# Altium schematic sheet main_robot_mpu.SchDoc
size A2
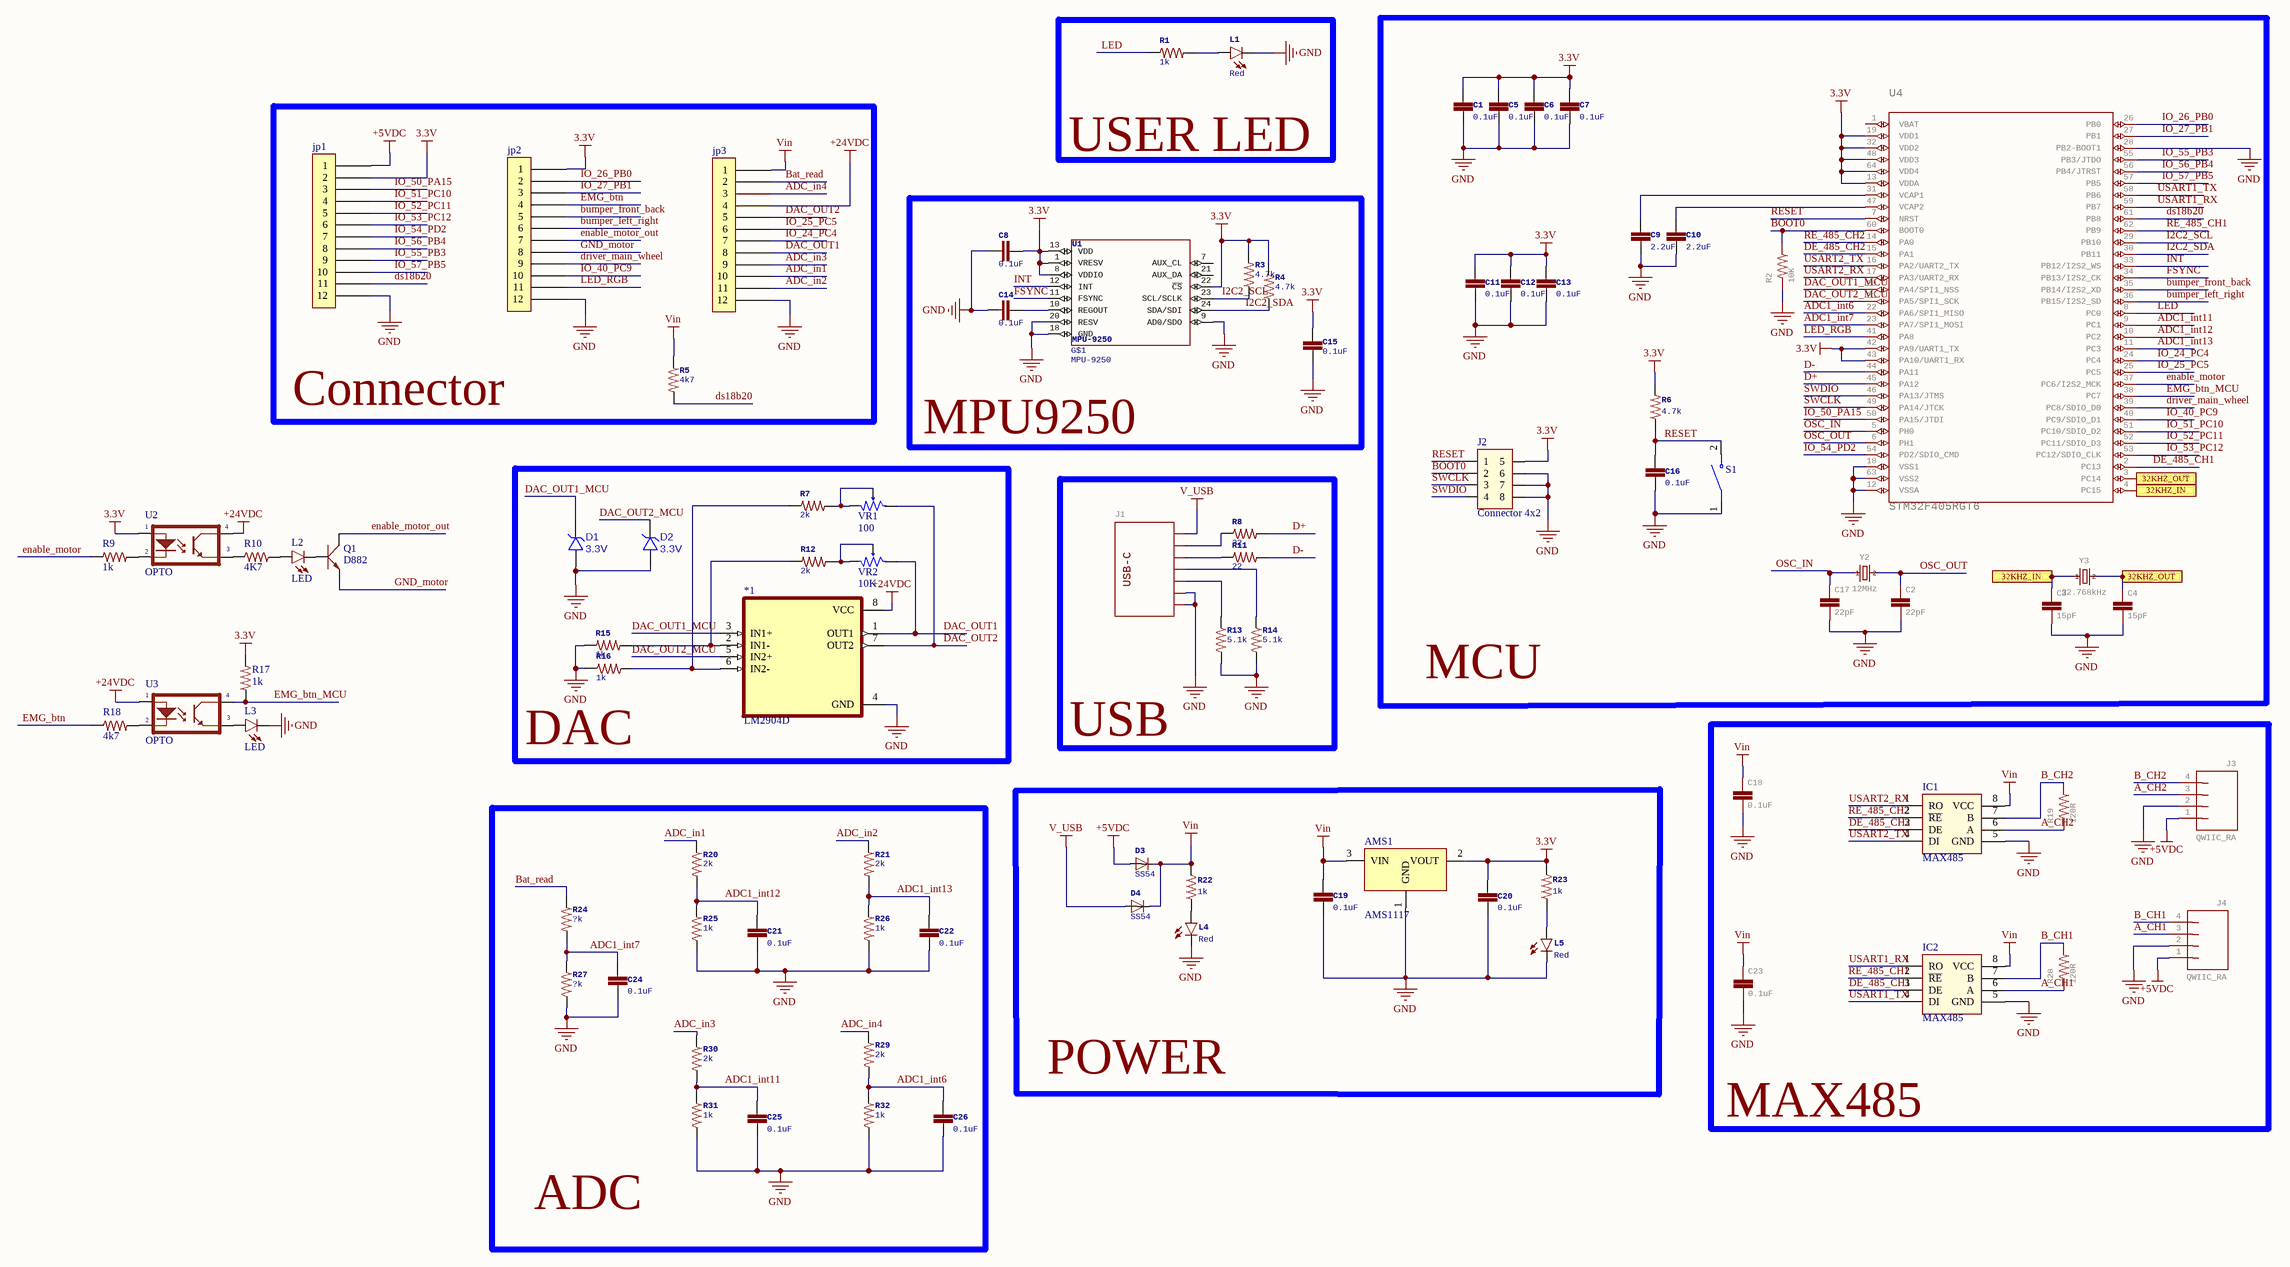
[diagram p0: main_robot_mpu.SchDoc]

## Parts
*1  LM2904D  [SOIC 8]
AMS1  AMS1117  [SOT89]
C1  0.1uF  [CAP_SMD0603]
C2  22pF  [0603-CAP]
C3  15pF  [0603-CAP]
C4  15pF  [0603-CAP]
C5  0.1uF  [CAP_SMD0603]
C6  0.1uF  [CAP_SMD0603]
C7  0.1uF  [CAP_SMD0603]
C8  0.1uF  [CAP_SMD0603]
C9  2.2uF  [CAP_SMD0603]
C10  2.2uF  [CAP_SMD0603]
C11  0.1uF  [CAP_SMD0603]
C12  0.1uF  [CAP_SMD0603]
C13  0.1uF  [CAP_SMD0603]
C14  0.1uF  [CAP_SMD0603]
C15  0.1uF  [CAP_SMD0603]
C16  0.1uF  [CAP_SMD0603]
C17  22pF  [0603-CAP]
C18  0.1uF  [0603-CAP]
C19  0.1uF  [CAP_SMD0603]
C20  0.1uF  [CAP_SMD0603]
C21  0.1uF  [CAP_SMD0603]
C22  0.1uF  [CAP_SMD0603]
C23  0.1uF  [0603-CAP]
C24  0.1uF  [CAP_SMD0603]
C25  0.1uF  [CAP_SMD0603]
C26  0.1uF  [CAP_SMD0603]
D1  3.3V  [SOD323]
D2  3.3V  [SOD323]
D3  SS54  [SMB]
D4  SS54  [SMB]
IC1  MAX485  [SO-8]
IC2  MAX485  [SO-8]
J1  USB_C_2-LAYER_PADS  [USB-C-16P-2LAYER-PADS]  (value not drawn)
J2  Connector 4x2  [JP4x2]
J3  QWIIC_RA  [JST04_1MM_RA]
J4  QWIIC_RA  [JST04_1MM_RA]
jp1  jumper 12p 2.54mm  [jumper 12p 2.54mm]  (value not drawn)
jp2  jumper 12p 2.54mm  [jumper 12p 2.54mm]  (value not drawn)
jp3  jumper 12p 2.54mm  [jumper 12p 2.54mm]  (value not drawn)
L1  Red  [LED_RED_SMD_0603]
L2  LED  [LED_GREEN_SMD_0603]
L3  LED  [LED_RED_SMD_0603]
L4  Red  [LED_YELLOW_SMD_0603]
L5  Red  [LED_GREEN_SMD_0603]
Q1  D882  [SOT89]
R1  1k  [RES_SMD0603]
R2  10K  [0603-RES]
R3  4.7k  [RES_SMD0603]
R4  4.7k  [RES_SMD0603]
R5  4k7  [RES_SMD0603]
R6  4.7k  [RES_SMD0603]
R7  2k  [RES_SMD0603]
R8  22  [RES_SMD0603]
R9  1k  [RES_SMD0603]
R10  4K7  [RES_SMD0603]
R11  22  [RES_SMD0603]
R12  2k  [RES_SMD0603]
R13  5.1k  [RES_SMD0603]
R14  5.1k  [RES_SMD0603]
R15  1k  [RES_SMD0603]
R16  1k  [RES_SMD0603]
R17  1k  [RES_SMD0603]
R18  4k7  [RES_SMD0603]
R19  120R  [0603-RES]
R20  2k  [RES_SMD0603]
R21  2k  [RES_SMD0603]
R22  1k  [RES_SMD0603]
R23  1k  [RES_SMD0603]
R24  ?k  [RES_SMD0603]
R25  1k  [RES_SMD0603]
R26  1k  [RES_SMD0603]
R27  ?k  [RES_SMD0603]
R28  120R  [0603-RES]
R29  2k  [RES_SMD0603]
R30  2k  [RES_SMD0603]
R31  1k  [RES_SMD0603]
R32  1k  [RES_SMD0603]
S1  PTS636_SM43J_SMTR_LFS  [BUTTON_3x4]  (value not drawn)
U1  MPU-9250  GateName_1: G$1  [QFN-24]
U2  OPTO  [SOP4]
U3  OPTO  [SOP4]
U4  STM32F405RGT6  [TQFP64]
VR1  100  [VR - SMD]
VR2  10K  [VR - SMD]
Y2  12MHz  [CRYSTAL-SMD-5X3.2-4PAD]
Y3  32.768kHz  [CRYSTAL-SMD-3.2X1.5MM]

## Ports
32KHZ_IN (in), 32KHZ_OUT (in)

## Nets
3.3V: AMS1.2(VOUT) C1.2 C5.2 C6.2 C7.2 C8.1 C11.2 C12.2 C13.2 C15.1 C20.2 J2.5 jp1.2 jp2.1 R3.1 R4.1 R6.1 R17.1 R23.1 U1.1(VRESV) U1.8(VDDIO) U1.13(VDD) U1.22(~{CS}) U2.1(A) U4.13(VDDA) U4.19(VDD1) U4.32(VDD2) U4.42(PA9/UART1_TX) U4.43(PA10/UART1_RX) U4.48(VDD3) U4.64(VDD4)
+5VDC: D3.1 J3.1 J4.1 jp1.1
+24VDC: *1.8(VCC) jp3.4 U2.4(C) U3.1(A)
GND: *1.4(GND) AMS1.1(GND) C1.1 C2.1 C3.1 C4.1 C5.1 C6.1 C7.1 C8.2 C9.1 C10.1 C11.1 C12.1 C13.1 C14.2 C15.2 C16.1 C17.1 C18.1 C19.1 C20.1 C21.1 C22.1 C23.1 C24.1 C25.1 C26.1 D1.A D2.A IC1.5(GND) IC2.5(GND) J1.GND J1.SHLD1(SHLD) J2.6 J2.7 J2.8 J3.2 J4.2 jp1.12 jp2.12 jp3.12 L1.2(POS) L3.2(POS) L4.2(POS) L5.2(POS) R2.1 R13.1 R14.1 R15.1 R16.1 R25.1 R26.1 R27.1 R31.1 R32.1 S1.1(COM) U1.9(AD0/SDO) U1.18(GND) U1.20(RESV) U4.12(VSSA) U4.18(VSS1) U4.28(PB2-BOOT1) U4.63(VSS2)
V_USB: D4.1 J1.VBUS1(VBUS)
Vin: AMS1.3(VIN) C18.2 C19.2 C23.2 D3.2 D4.2 IC1.8(VCC) IC2.8(VCC) jp3.1 R5.2 R22.1
32KHZ_IN: C3.2 U4.4(PC15) Y3.1 ; port 32KHZ_IN
32KHZ_OUT: C4.2 U4.3(PC14) Y3.3 ; port 32KHZ_OUT
A_CH1: IC2.6(A) J4.3 R28.1
A_CH2: IC1.6(A) J3.3 R19.1
ADC1_int6: C26.2 R29.1 R32.2 U4.22(PA6/SPI1_MISO)
ADC1_int7: C24.2 R24.1 R27.2 U4.23(PA7/SPI1_MOSI)
ADC1_int11: C25.2 R30.1 R31.2 U4.9(PC1)
ADC1_int12: C21.2 R20.1 R25.2 U4.10(PC2)
ADC1_int13: C22.2 R21.1 R26.2 U4.11(PC3)
ADC_in1: jp3.10 R20.2
ADC_in2: jp3.11 R21.2
ADC_in3: jp3.9 R30.2
ADC_in4: jp3.3 R29.2
B_CH1: IC2.7(B) J4.4 R28.2
B_CH2: IC1.7(B) J3.4 R19.2
Bat_read: jp3.2 R24.2
BOOT0: J2.2 R2.2 U4.60(BOOT0)
bumper_front_back: jp2.5 U4.35(PB14/I2S2_XD)
bumper_left_right: jp2.6 U4.36(PB15/I2S2_SD)
D+: R8.2 U4.45(PA12)
D-: R11.2 U4.44(PA11)
DAC_OUT1: *1.1(OUT1) jp3.8 VR2.3
DAC_OUT1_MCU: *1.3(IN1+) D1.K U4.20(PA4/SPI1_NSS)
DAC_OUT2: *1.7(OUT2) jp3.5 VR1.3
DAC_OUT2_MCU: *1.5(IN2+) D2.K U4.21(PA5/SPI1_SCK)
DE_485_CH1: IC2.3(DE) U4.2(PC13)
DE_485_CH2: IC1.3(DE) U4.15(PA1)
driver_main_wheel: jp2.9 U4.39(PC8/SDIO_D0)
ds18b20: jp1.11 R5.1 U4.61(PB8)
EMG_btn: jp2.4 R18.2
EMG_btn_MCU: R17.2 U3.4(C) U4.38(PC7)
enable_motor: R9.2 U4.37(PC6/I2S2_MCK)
enable_motor_out: jp2.7 Q1.3(COLLECTOR)
FSYNC: U1.11(FSYNC) U4.34(PB13/I2S2_CK)
GND_motor: jp2.8 Q1.2(EMITTER)
I2C2_SCL: R3.2 U1.23(SCL/SCLK) U4.29(PB10)
I2C2_SDA: R4.2 U1.24(SDA/SDI) U4.30(PB11)
INT: U1.12(INT) U4.33(PB12/I2S2_WS)
IO_24_PC4: jp3.7 U4.24(PC4)
IO_25_PC5: jp3.6 U4.25(PC5)
IO_26_PB0: jp2.2 U4.26(PB0)
IO_27_PB1: jp2.3 U4.27(PB1)
IO_40_PC9: jp2.10 U4.40(PC9/SDIO_D1)
IO_50_PA15: jp1.3 U4.50(PA15/JTDI)
IO_51_PC10: jp1.4 U4.51(PC10/SDIO_D2)
IO_52_PC11: jp1.5 U4.52(PC11/SDIO_D3)
IO_53_PC12: jp1.6 U4.53(PC12/SDIO_CLK)
IO_54_PD2: jp1.7 U4.54(PD2/SDIO_CMD)
IO_55_PB3: jp1.9 U4.55(PB3/JTDO)
IO_56_PB4: jp1.8 U4.56(PB4/JTRST)
IO_57_PB5: jp1.10 U4.57(PB5)
LED: R1.2 U4.8(PC0)
LED_RGB: jp2.11 U4.41(PA8)
OSC_IN: C17.2 U4.5(PH0) Y2.1
OSC_OUT: C2.2 U4.6(PH1) Y2.3
RE_485_CH1: IC2.2(~{RE}) U4.62(PB9)
RE_485_CH2: IC1.2(~{RE}) U4.14(PA0)
RESET: C16.2 J2.1 R6.2 S1.2(NO) U4.7(NRST)
SWCLK: J2.3 U4.49(PA14/JTCK)
SWDIO: J2.4 U4.46(PA13/JTMS)
USART1_RX: IC2.1(RO) U4.59(PB7)
USART1_TX: IC2.4(DI) U4.58(PB6)
USART2_RX: IC1.1(RO) U4.17(PA3/UART2_RX)
USART2_TX: IC1.4(DI) U4.16(PA2/UART2_TX)
Net*1_2: *1.2(IN1-) R12.1 R15.2
Net*1_6: *1.6(IN2-) R7.1 R16.2
NetC9_2: C9.2 U4.31(VCAP1)
NetC10_2: C10.2 U4.47(VCAP2)
NetC14_1: C14.1 U1.10(REGOUT)
NetJ1_A5: J1.A5(CC1) R14.2
NetJ1_A6: J1.A6(D+) R8.1
NetJ1_A7: J1.A7(D-) R11.1
NetJ1_B5: J1.B5(CC2) R13.2
NetL1_1: L1.1(NEG) R1.1
NetL2_1: L2.1(NEG) R10.1
NetL2_2: L2.2(POS) Q1.1(BASE)
NetL3_1: L3.1(NEG) U3.3(E)
NetL4_1: L4.1(NEG) R22.2
NetL5_1: L5.1(NEG) R23.2
NetR7_2: R7.2 VR1.1 VR1.2
NetR9_1: R9.1 U2.2(K)
NetR10_2: R10.2 U2.3(E)
NetR12_2: R12.2 VR2.1 VR2.2
NetR18_1: R18.1 U3.2(K)

Not connected (* = marked no-connect by the designer): J1 B6(D+) B7(D-) SHLD2(SHLD) SHLD3(SHLD) SHLD4(SHLD) VBUS2(VBUS); U1 7(AUX_CL) 21(AUX_DA); U4 1(VBAT)

## Notes on the sheet
- Labels drawn without touching a wire or pin: ADC, Connector, DAC, MAX485, MCU, MPU9250, POWER, USB, USER LED
- Name
- Date
- Sign
- Designer
- Checker
- Address:
- TEL:
- Website:
- Drawing:
- Size:
- A3
- Sheet:
- /
- Code:

## Library data of the parts
C1 C5-C16 C19-C22 C24-C26 = Cap
C2-C4 C17 C18 C23 = CAP0603-CAP: CapacitorStandard 0603 ceramic capacitor, and 0.1" leaded capacitor.; GateName_1: G$1; SymbolName_1: CAP; DeviceName: 0603-CAP; LibraryName: SparkFun; DeviceSetName: CAP
D1 D2 = DIODE_ZENER_3V3_SOD323: Diode Zener SMD 3.3V 200mW SOD-323; Manufacturer 1: ON Semiconductor; Manufacturer Part Number 1: MM3Z3V3ST1G; Ratings: 3.3V; 0.2W; Vf=900mV @ 10mA; Material: Si; Tolerance: ±3%; SCDType: source; Package / Case: SOD-323; Diode Type: Zener; Supplier 1: Digi-Key; Supplier Part Number 1: MM3Z3V3ST1GOSCT-ND
D3 D4 = DIODE
IC1 IC2 = MAX485: RS232 - RS485 (Same sn75176)
J1 = USB_C_2-LAYER_PADS: USB Type C 16Pin Connector Super Speed pins not available on the 16-pin purely SMD connector so this part is best for USB 2.0 implementations. D1 and D2 are tied together enabling D+/- no matter which way the cable is plugged into the connector. The two channel configuration pins (CC1/2) are exposed. These are normally connected to ground via 5.1k resistors but can be reconfigured for high current/high power applications.; GateName_1: J1; SymbolName_1: USB-C-MINIMUM; DeviceSetName: USB_C; PROD_ID: CONN-14122; DeviceName: _2-LAYER_PADS; LibraryName: SparkFun-Connectors; USB-C: USB-C
J2 = JP4x2: Value: Connector 4x2
J3 J4 = QWIIC_CONNECTORJS-1MM: SparkFun I2C Standard Qwiic Connector An SMD 1mm pitch JST connector makes it easy and quick (get it? Qwiic?) to connect I2C devices to each other. The Qwiic system enables fast and solderless connection between popular platforms and various sensors and actuators.   We carry 200mm, 100mm, 50mm, and breadboard friendly Qwiic cables. We also offer 10 pcs strips the SMD connectors.; GateName_1: G$1; SymbolName_1: I2C_STANDARD; DeviceName: JS-1MM; PROD_ID: CONN-13694; LibraryName: SparkFun-Connectors; DeviceSetName: QWIIC_CONNECTOR
jp1-jp3 = jumper 12p 2.54mm: jp 12p 2.54mm
L1-L5 = LED: Lighting Eminter Diode
Q1 = Tranzitor NPN: pin to pad: 2>3 3>2
R1 R3-R18 R20-R27 R29-R32 = Resistor
R2 R19 R28 = RESISTOR0603-RES: ResistorBasic schematic elements and footprints for 0603, 1206, and PTH resistors.; GateName_1: G$1; SymbolName_1: RESISTOR; DeviceName: 0603-RES; LibraryName: SparkFun; DeviceSetName: RESISTOR
S1 = PTS636_SM43J_SMTR_LFS: Tactile Switch SPST-NO Top Actuated Surface Mount; MP: PTS636 SM43J SMTR LFS; MF: C&K; Package: None; Value: *; Availability: Unavailable; Price: None; SnapEDA_Link: https://www.snapeda.com/parts/PTS636%20SM43J%20SMTR%20LFS/C%26K/view-part/4478349/?ref=snap
U1 = MPU-9250: 9-axis MotionTracking: 3-Axis gyroscope, 3-Axis accelerometer, 3-Axis magnetometer NC pin 19. 2-6 & 14-17 not internally connected. May be used for PCB trace routing.; PROD_ID: IC-13192; SymbolName_1: MPU-9250; LibraryName: 9dof-devboard-temp; DeviceSetName: MPU-9250
U4 = STM32F405RG: STM32F405RGT6    ARM DSP Chip used on the WAV Trigger board. IC MCU 32BIT 1MB FLASH 64LQFP   Datasheet SparkFun Products  WAV Trigger (WIG-13660); GateName_1: G$1; PROD_ID: IC-11709; SymbolName_1: STM32F405RG; LibraryName: STM32_Temp; DeviceSetName: STM32F405RG
VR1 = VR: Var Resistor RM065; RM065-104: 10K; RM065-503: 5K; RM065-103: 1K
VR2 = VR: Var Resistor RM065; RM065-503: 5K; RM065-103: 1K; RM065-104: 10K
Y2 = CRYSTAL-12MHZ": 12.0MHz Crystal  Frequency: 12.0MHz  Frequency Tolerance: &plusmn;20ppm  Load Capacitance: 18pF       SparkFun Products: SparkFun Logomatic  Pocket AVR Programmer; GateName_1: G$1; DeviceName: "; PROD_ID: XTAL-08297; SymbolName_1: CRYSTAL; LibraryName: SparkFun-Clocks; DeviceSetName: CRYSTAL-12MHZ; 1: 1; 2: 2
Y3 = CRYSTAL-12MHZ": 12.0MHz Crystal  Frequency: 12.0MHz  Frequency Tolerance: &plusmn;20ppm  Load Capacitance: 18pF       SparkFun Products: SparkFun Logomatic  Pocket AVR Programmer; pin to pad: 3>2; GateName_1: G$1; DeviceName: "; PROD_ID: XTAL-08297; SymbolName_1: CRYSTAL; LibraryName: SparkFun-Clocks; DeviceSetName: CRYSTAL-12MHZ; 1: 1; 2: 2